# EasyEDA Pro project Usb_C_Hub-EasyEdaPro_Project.epro

# Schematic Schematic1_1
Board Name: Board1_1; Create Date: 2026-06-02; Page Name: P1; Project Name: Usb_Hub; Schematic Name: Schematic1_1; Update Date: 2026-06-02; Company: EasyEDA.com; Page Size: A4; Version: V1.0
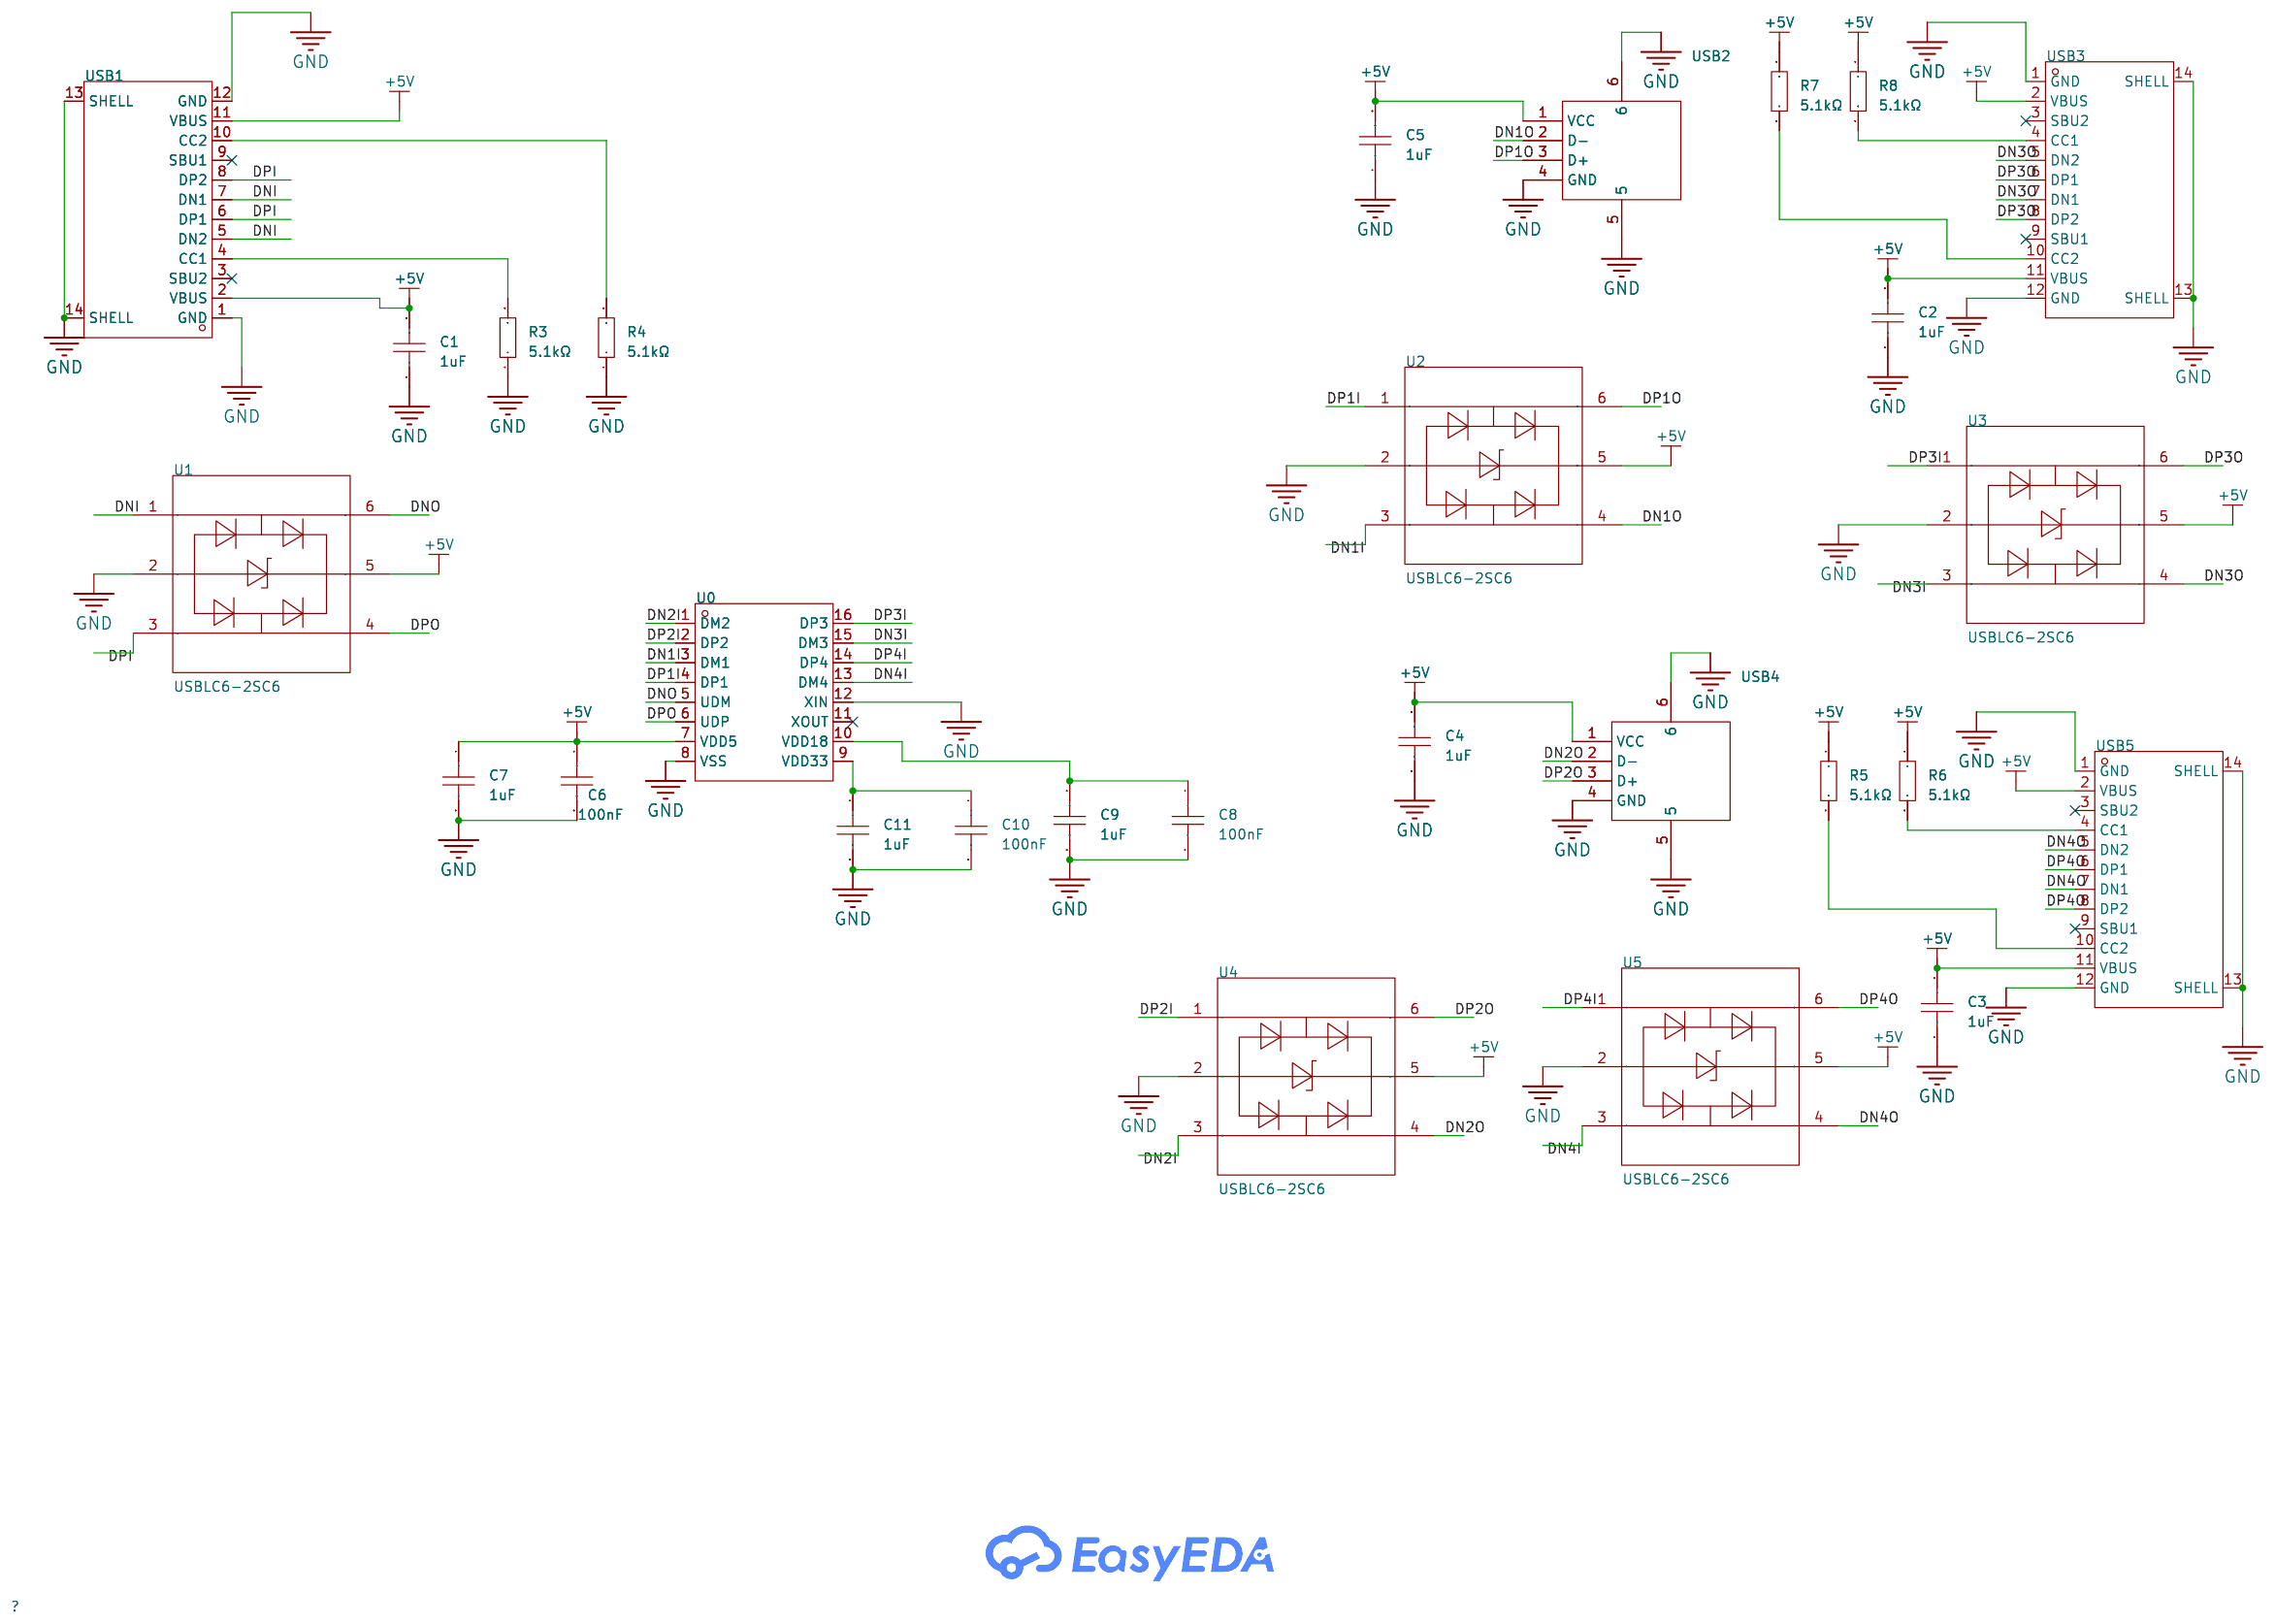
[diagram p0: schematic sheet]

## Parts
C1  1uF  [C0603]
C2  1uF  [C0603]
C3  1uF  [C0603]
C4  1uF  [C0603]
C5  1uF  [C0603]
C6  100nF  [C0603]
C7  1uF  [C0603]
C8  100nF  [C0603]
C9  1uF  [C0603]
C10  100nF  [C0603]
C11  1uF  [C0603]
R3  5.1kΩ  [R0603]
R4  5.1kΩ  [R0603]
R5  5.1kΩ  [R0603]
R6  5.1kΩ  [R0603]
R7  5.1kΩ  [R0603]
R8  5.1kΩ  [R0603]
U0  SL2.1s  [SSOP-16_L4.6-W2.6-P0.53-LS4.0-BL]
U1  USBLC6-2SC6  [SOT-23-6_L2.9-W1.6-P0.95-LS2.8-BR]
U2  USBLC6-2SC6  [SOT-23-6_L2.9-W1.6-P0.95-LS2.8-BR]
U3  USBLC6-2SC6  [SOT-23-6_L2.9-W1.6-P0.95-LS2.8-BR]
U4  USBLC6-2SC6  [SOT-23-6_L2.9-W1.6-P0.95-LS2.8-BR]
U5  USBLC6-2SC6  [SOT-23-6_L2.9-W1.6-P0.95-LS2.8-BR]
USB1  TYPE-C 16PIN 2MD(073)  [USB-C-SMD_TYPE-C-6PIN-2MD-073]
USB2  10.0 QHHTZB6.3  [USB-A-TH_10.0QHHTZB6.3]
USB3  TYPE-C 16PIN 2MD(073)  [USB-C-SMD_TYPE-C-6PIN-2MD-073]
USB4  10.0 QHHTZB6.3  [USB-A-TH_10.0QHHTZB6.3]
USB5  TYPE-C 16PIN 2MD(073)  [USB-C-SMD_TYPE-C-6PIN-2MD-073]

## Library data of the parts
C1-C5 C7 C9 C11 = CL10A105KB8NNNC: Capacitance:1uF Tolerance:±10% Tolerance:±10% Voltage Rating:50V Temperature Coefficient:X5R; LCSC Part Name: 1uF ±10% 50V; Supplier Part: C15849; Manufacturer: SAMSUNG(三星); Supplier Footprint: 0603; JLCPCB Part Class: Basic Part; Datasheet: https://item.szlcsc.com/datasheet/CL10A105KB8NNNC/16531.html; Supplier: LCSC; Tolerance: ±10%; Voltage Rating: 50V; Temperature Coefficient: X5R
C6 C8 C10 = CC0603KRX7R9BB104: Capacitance:100nF Tolerance:±10% Tolerance:±10% Voltage Rating:50V Temperature Coefficient:X7R; LCSC Part Name: 100nF ±10% 50V; Supplier Part: C14663; Manufacturer: YAGEO(国巨); Supplier Footprint: 0603; JLCPCB Part Class: Basic Part; Datasheet: https://item.szlcsc.com/datasheet/CC0603KRX7R9BB104/15331.html; Supplier: LCSC; Tolerance: ±10%; Voltage Rating: 50V; Temperature Coefficient: X7R
R3-R8 = 0603WAF5101T5E: Type:Thick Film Resistor Resistance:5.1kΩ Tolerance:±1% Tolerance:±1% Power(Watts):100mW Voltage-Supply(Max):75V Temperature Coefficient:±100ppm/℃ Temperature Coefficient:±100ppm/℃ Operating Temperature:-55℃~+155℃ Operating Temperature:-55℃~+155℃; LCSC Part Name: 5.1kΩ ±1% 100mW 厚膜电阻; Supplier Part: C23186; Manufacturer: UNI-ROYAL(厚声); Supplier Footprint: 0603; JLCPCB Part Class: Basic Part; Datasheet: https://item.szlcsc.com/datasheet/0603WAF5101T5E/23913.html; Supplier: LCSC; Type: Thick Film Resistor; Tolerance: ±1%; Power(Watts): 100mW; Voltage-Supply(Max): 75V; Temperature Coefficient: ±100ppm/℃; Operating Temperature: -55℃~+155℃
U0 = SL2.1s: type:Hub USB Protocol:USB 2.0 Voltage - Supply:4V~5.25V Voltage - Supply:4V~5.25V Operating Temperature:0℃~+70℃ Operating Temperature:0℃~+70℃ Current - Supply:120mA Quiescent Supply Current:2.5mA Number of Channels:4; LCSC Part Name: USB2.0 HUB控制器集成电路; Supplier Part: C2684433; Manufacturer: CoreChips(和芯润德); Supplier Footprint: SSOP-16; JLCPCB Part Class: Extended Part; Datasheet: https://item.szlcsc.com/datasheet/SL2.1s/2782346.html; Supplier: LCSC; type: Hub; USB Protocol: USB 2.0; Voltage - Supply: 4V~5.25V; Operating Temperature: 0℃~+70℃; Current - Supply: 120mA; Quiescent Supply Current: 2.5mA; Number of Channels: 4
U1-U5 = USBLC6-2SC6_C5261088: Polarity:Bidirectional Reverse Stand-Off Voltage (Vrwm):5V Clamping Voltage:14V Peak Pulse Current (Ipp):6A Voltage - Breakdown:6V Reverse Leakage Current (Ir):1uA Number of Channels:2 level of protection:IEC 61000-4-2 Type:ESD Junction Capacitance:0.5pF；; LCSC Part Name: 2路 双向ESD 5V截止 峰值脉冲电流：6A; Supplier Part: C5261088; Manufacturer: HXY MOSFET(华轩阳电子); Supplier Footprint: SOT-23-6L; JLCPCB Part Class: Extended Part; Datasheet: https://item.szlcsc.com/datasheet/USBLC6-2SC6/5983787.html; Supplier: LCSC; Polarity: Bidirectional; Reverse Stand-Off Voltage (Vrwm): 5V; Clamping Voltage: 14V; Peak Pulse Current (Ipp): 6A; Voltage - Breakdown: 6V; Reverse Leakage Current (Ir): 1uA; Number of Channels: 2; level of protection: IEC 61000-4-2; Type: ESD; Junction Capacitance: 0.5pF；0.8pF
USB1 USB3 USB5 = TYPE-C 16PIN 2MD(073): Connector Type:Type-C Protocol Standard:- Gender:Female Mounting Type:Surface Mount, Right Angle Number of Contacts:16P Number of Ports:1 Current Rating-Power:3A Voltage Rating:5V Connect-Disconnect Life:10,000 Cycles Supplementary Features:- Center Heigh; LCSC Part Name: Type-C 母 卧贴; Supplier Part: C2765186; Manufacturer: SHOU HAN(首韩); Supplier Footprint: SMD; JLCPCB Part Class: Extended Part; Datasheet: https://item.szlcsc.com/datasheet/TYPE-C%252016PIN%25202MD(073)/2901843.html; Supplier: LCSC; Connector Type: Type-C; Gender: Female; Mounting Type: Surface Mount, Right Angle; Number of Contacts: 16P; Number of Ports: 1; Current Rating-Power: 3A; Voltage Rating: 5V; Connect-Disconnect Life: 10,000 Cycles; Detection color: Black; Operating Temperature: -25℃~+85℃; Check: false
USB2 USB4 = 10.0 QHHTZB6.3: Connector Type:Type-A Protocol Standard:USB 2.0 Gender:Female Mounting Type:Surface Mount, Right Angle Number of Contacts:4P Number of Ports:1 Current Rating-Power:1.5A Voltage Rating:30V Connect-Disconnect Life:5,000 times Supplementary Features:- Center; LCSC Part Name: 壳长10.0mm; Supplier Part: C668591; Manufacturer: SHOU HAN(首韩); Supplier Footprint: SMD; JLCPCB Part Class: Extended Part; Datasheet: https://item.szlcsc.com/datasheet/10.0%2520QHHTZB6.3/698534.html; Supplier: LCSC; Connector Type: Type-A; Protocol Standard: USB 2.0; Gender: Female; Mounting Type: Surface Mount, Right Angle; Number of Contacts: 4P; Number of Ports: 1; Current Rating-Power: 1.5A; Voltage Rating: 30V; Connect-Disconnect Life: 5,000 times; Length: 10mm; Detection color: Black; Operating Temperature: -25℃~+85℃

## Nets
+5V: C1.2 C2.2 C3.2 C4.2 C5.2 C6.1 C7.1 R5.1 R6.1 R7.1 R8.1 U0.7(VDD5) U1.5 U2.5 U3.5 U4.5 U5.5 USB1.2(VBUS) USB1.11(VBUS) USB2.1(VCC) USB3.2(VBUS) USB3.11(VBUS) USB4.1(VCC) USB5.2(VBUS) USB5.11(VBUS)
GND: C1.1 C2.1 C3.1 C4.1 C5.1 C6.2 C7.2 C8.2 C9.2 C10.2 C11.2 R3.1 R4.1 U0.8(VSS) U0.12(XIN) U1.2 U2.2 U3.2 U4.2 U5.2 USB1.1(GND) USB1.12(GND) USB1.13(SHELL) USB1.14(SHELL) USB2.4(GND) USB2.5 USB2.6 USB3.1(GND) USB3.12(GND) USB3.13(SHELL) USB3.14(SHELL) USB4.4(GND) USB4.5 USB4.6 USB5.1(GND) USB5.12(GND) USB5.13(SHELL) USB5.14(SHELL)
DN1I: U0.3(DM1) U2.3
DN1O: U2.4 USB2.2(D-)
DN2I: U0.1(DM2) U4.3
DN2O: U4.4 USB4.2(D-)
DN3I: U0.15(DM3) U3.3
DN3O: U3.4 USB3.5(DN2) USB3.7(DN1)
DN4I: U0.13(DM4) U5.3
DN4O: U5.4 USB5.5(DN2) USB5.7(DN1)
DNI: U1.1 USB1.5(DN2) USB1.7(DN1)
DNO: U0.5(UDM) U1.6
DP1I: U0.4(DP1) U2.1
DP1O: U2.6 USB2.3(D+)
DP2I: U0.2(DP2) U4.1
DP2O: U4.6 USB4.3(D+)
DP3I: U0.16(DP3) U3.1
DP3O: U3.6 USB3.6(DP1) USB3.8(DP2)
DP4I: U0.14(DP4) U5.1
DP4O: U5.6 USB5.6(DP1) USB5.8(DP2)
DPI: U1.3 USB1.6(DP1) USB1.8(DP2)
DPO: U0.6(UDP) U1.4
$1N2151: R3.2 USB1.4(CC1)
$1N2154: R4.2 USB1.10(CC2)
$1N2984: R5.2 USB5.10(CC2)
$1N3131: R6.2 USB5.4(CC1)
$1N3260: R7.2 USB3.10(CC2)
$1N3267: R8.2 USB3.4(CC1)
$1N3816: C10.1 C11.1 U0.9(VDD33)
$1N3846: C8.1 C9.1 U0.10(VDD18)

Not connected (* = marked no-connect by the designer): U0 11(XOUT)*; USB1 3(SBU2)* 9(SBU1)*; USB3 3(SBU2)* 9(SBU1)*; USB5 3(SBU2)* 9(SBU1)*

# Board PCB1_1
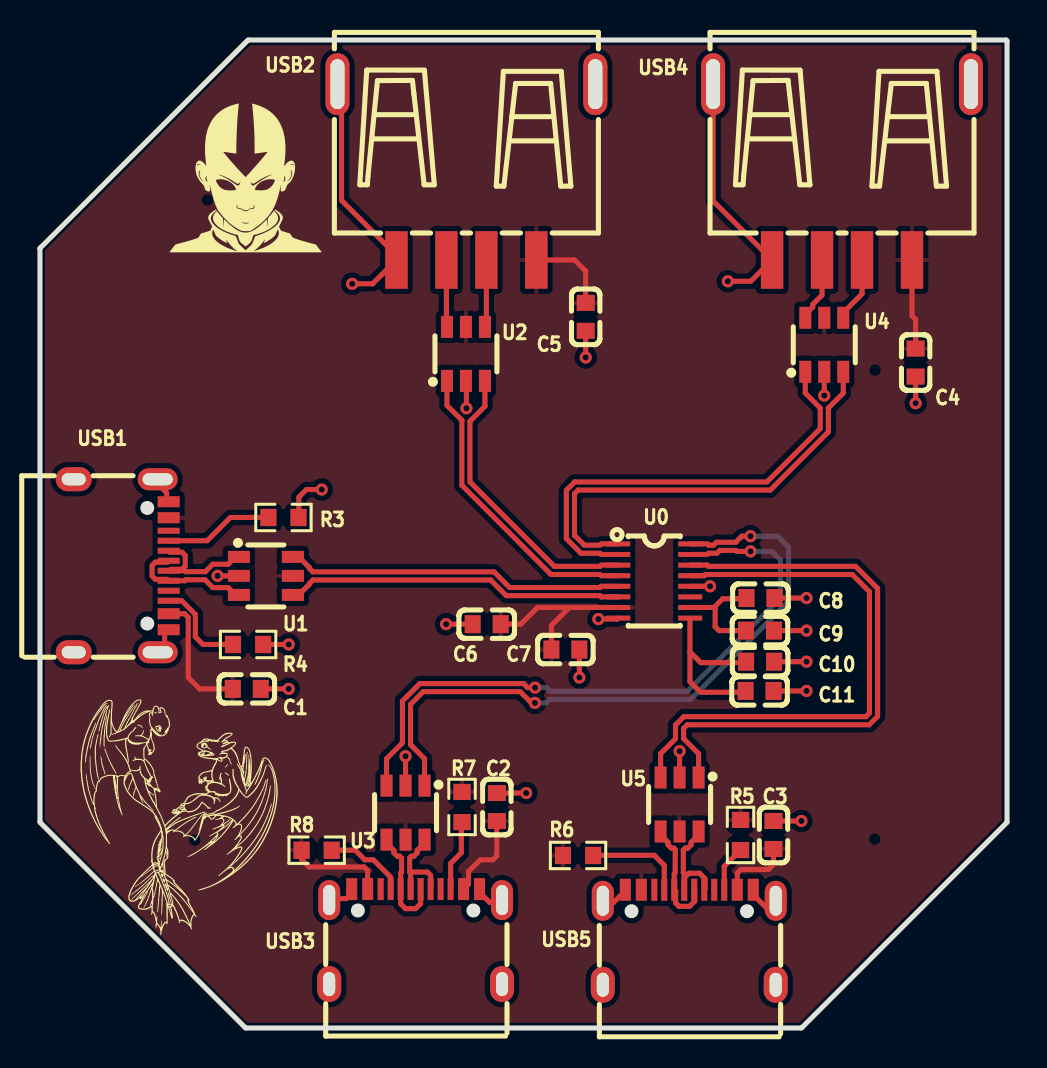
[diagram p1: board, top side]
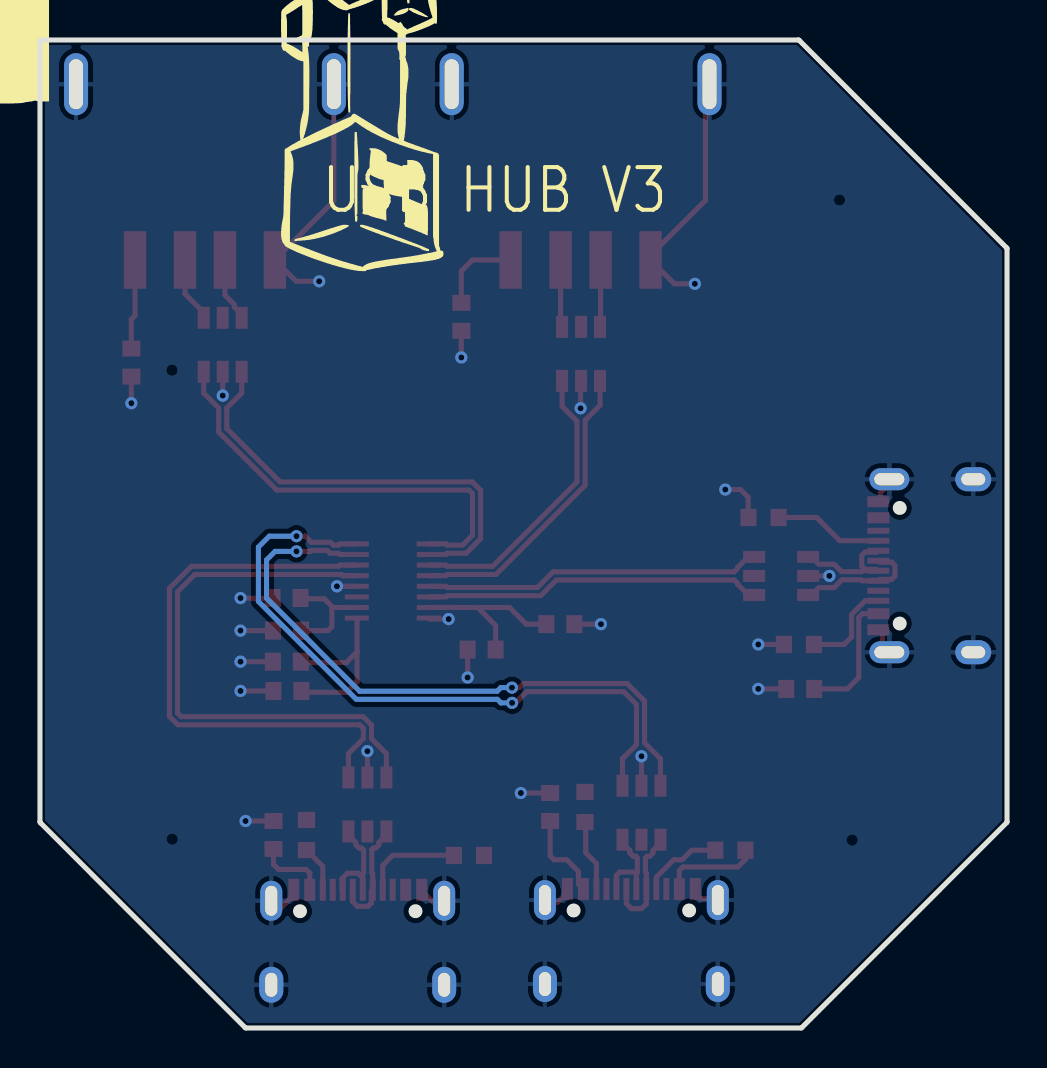
[diagram p2: board, bottom side, seen from below]

Outline 48.39 x 49.4 mm; copper layers: Top Layer, Bottom Layer. Coordinates in mm from the lower left corner of the outline.
Outline path: 0,38.97 0,10.31 arc(0,10.29) 0.02,10.27 10.27,0.01 arc(10.29,0) 10.31,0 38.08,0 arc(38.1,0) 38.11,0.01 48.37,10.27 arc(48.38,10.29) 48.39,10.31 48.39,49.35 arc(48.37,49.39) 48.34,49.4 10.44,49.4 arc(10.42,49.4) 10.4,49.39 0.02,39 arc(0,38.99) 0,38.97
Stack: Top Layer 0.035mm / Dielectric1 1.51mm FR4 er 4.5 / Bottom Layer 0.035mm

## Design rules (mm)
net DNO: DP2
net DPO: DP2
net DN2I: DP11
net DP2I: DP11
net DN4O: DP6
net DP4O: DP6
net DN3O: DP3
net DP3O: DP3
net DP1O: DP8
net DN1O: DP8
net DP2O: DP10
net DN2O: DP10
net DN1I: DP9
net DP1I: DP9
net DN3I: DP5
net DP3I: DP5
net DN4I: DP7
net DP4I: DP7
net DPI: DP1
net DNI: DP1
template: Custom Config
spacing copperThickness1oz (default): track to track 0.102, other pairs 0.152 to 0.3
spacing copperThickness2oz: track to track 0.203, other pairs 0.152 to 0.3
track width copperThickness1oz (default): min 0.127, default 0.254, max 2.54
track width copperThickness2oz: min 0.203, default 0.254, max 2.54
differential pair differentialPair (default): width min 0.127, default 0.254, max 2.54; gap min 0.152, default 0.152
via viaSize (default): diameter min 0.5, default 0.61, max 10; hole min 0.3, default 0.305, max 6.3

## Placement (name value [footprint] x y rotation side)
C1  1uF  [C0603]  10.35 16.96 180 top
C2  1uF  [C0603]  22.86 11.05 270 top
C3  1uF  [C0603]  36.7 9.65 270 top
C4  1uF  [C0603]  43.82 33.27 90 top
C5  1uF  [C0603]  27.3 35.56 90 top
C6  100nF  [C0603]  22.35 20.19 180 top
C7  1uF  [C0603]  26.29 18.92 0 top
C8  100nF  [C0603]  36.05 21.5 0 top
C9  1uF  [C0603]  36.03 19.87 0 top
C10  100nF  [C0603]  36.03 18.32 0 top
C11  1uF  [C0603]  36.01 16.85 0 top
R3  5.1kΩ  [R0603]  12.18 25.53 180 top
R4  5.1kΩ  [R0603]  10.41 19.18 180 top
R5  5.1kΩ  [R0603]  35.05 9.65 270 top
R6  5.1kΩ  [R0603]  26.92 8.63 0 top
R7  5.1kΩ  [R0603]  21.12 11.05 270 top
R8  5.1kΩ  [R0603]  13.84 8.89 0 top
U0  SL2.1s  [SSOP-16_L4.6-W2.6-P0.53-LS4.0-BL]  30.73 22.35 270 top
U1  USBLC6-2SC6  [SOT-23-6_L2.9-W1.6-P0.95-LS2.8-BR]  11.3 22.61 180 top
U2  USBLC6-2SC6  [SOT-23-6_L2.9-W1.6-P0.95-LS2.8-BR]  21.31 33.71 270 top
U3  USBLC6-2SC6  [SOT-23-6_L2.9-W1.6-P0.95-LS2.8-BR]  18.29 10.77 90 top
U4  USBLC6-2SC6  [SOT-23-6_L2.9-W1.6-P0.95-LS2.8-BR]  39.24 34.16 270 top
U5  USBLC6-2SC6  [SOT-23-6_L2.9-W1.6-P0.95-LS2.8-BR]  32 11.18 90 top
USB1  TYPE-C 16PIN 2MD(073)  [USB-C-SMD_TYPE-C-6PIN-2MD-073]  4.06 23.11 270 top
USB2  10.0 QHHTZB6.3  [USB-A-TH_10.0QHHTZB6.3]  21.34 42.8 180 top
USB3  TYPE-C 16PIN 2MD(073)  [USB-C-SMD_TYPE-C-6PIN-2MD-073]  18.8 4.57 0 top
USB4  10.0 QHHTZB6.3  [USB-A-TH_10.0QHHTZB6.3]  40.13 42.8 180 top
USB5  TYPE-C 16PIN 2MD(073)  [USB-C-SMD_TYPE-C-6PIN-2MD-073]  32.49 4.54 0 top

## Footprints (pads in the part's own frame, mm; a bottom-side part is the same pattern mirrored in y, then rotated)
C0603
  rect 0.8x0.9 smd: 1(-0.7,0) 2(0.7,0)
R0603
  rect 0.806x0.864 smd: 1(-0.753,0) 2(0.753,0)
SOT-23-6_L2.9-W1.6-P0.95-LS2.8-BR
  rect 1.1x0.6 smd: 1(1.35,-0.95) 2(1.35,0) 3(1.35,0.95) 4(-1.35,0.95) 5(-1.35,0) 6(-1.35,-0.95)
SSOP-16_L4.6-W2.6-P0.53-LS4.0-BL
  rect 0.25x1.2 smd: 1(-1.855,-1.8) 2(-1.325,-1.8) 3(-0.795,-1.8) 4(-0.265,-1.8) 5(0.265,-1.8) 6(0.795,-1.8) 7(1.325,-1.8) 8(1.855,-1.8) 9(1.855,1.8) 10(1.325,1.8) 11(0.795,1.8) 12(0.265,1.8) 13(-0.265,1.8) 14(-0.795,1.8) 15(-1.325,1.8) 16(-1.855,1.8)
USB-A-TH_10.0QHHTZB6.3
  rect 1.12x2.88 smd: 1(-3.5,4.395) 2(-1,4.395) 3(1,4.395) 4(3.5,4.395)
  oval 1.2x3.1 hole 0.7x2.5: 5(-6.45,-4.395) 6(6.45,-4.395)
USB-C-SMD_TYPE-C-6PIN-2MD-073
  rect 0.55x1.1 smd: 1(-3.2,2.375) 2(-2.4,2.375) 11(2.4,2.375) 12(3.2,2.375)
  rect 0.3x1.1 smd: 3(-1.75,2.375) 4(-1.25,2.375) 5(-0.75,2.375) 6(-0.25,2.375) 7(0.25,2.375) 8(0.75,2.375) 9(1.25,2.375) 10(1.75,2.375)
  oval 1.1x2 hole 0.6x1.5: 13(-4.325,1.825) 14(4.325,1.825)
  oval 1.2x1.8 hole 0.6x1.2: 13(-4.325,-2.375) 14(4.325,-2.375)

## Nets
As in the schematic.

Pads without a net: U0 11; USB1 3 9; USB3 3 9; USB5 3 9

## Via types
v1: diameter 0.61, hole 0.305, Top Layer to Bottom Layer, 26 vias

## Routing (per net, layer and track width the routed paths; a pad name or vN(x,y) marks a point on that pad's centre or on a via; arc(x,y) is an arc through that point)
+5V: length 37
  Top Layer w0.254: R8.1 13.09,8.43 13.46,8.05 16.22,8.05 16.4,7.87 USB3.2 ; C4.2 43.82,35.43 43.63,35.62 USB4.1 ; 26.49,21.03 25.59,20.13 C7.1 ; 26.49,21.03 24.89,21.03 24.06,20.19 C6.1 ; 26.49,21.03 27.69,21.03 27.7,21.03 28.18,21.03 28.19,21.03 28.93,21.03 ; C1.2 7.99,16.96 7.42,17.53 7.42,20.53 7.24,20.71 USB1.11 ; C5.2 27.3,37.85 26.75,38.4 USB2.1 ; C2.2 22.86,8.61 22.66,8.41 22.03,8.41 21.44,7.82 21.44,7.19 USB3.11 ; USB5.11 34.89,7.75 35.07,7.93 36.45,7.93 36.7,8.18 C3.2
GND: length 60.5
  Top Layer w0.254: U2.2 21.34,32.34 v1(21.34,30.99) ; C5.1 v1(27.3,33.53) ; C1.1 v1(12.45,16.96) ; 17.73,38.74 15.09,41.38 15.09,46.96 ; v1(15.62,37.21) 16.64,37.21 USB2.4 ; C4.1 v1(43.82,31.24) ; U5.2 v1(32,13.84) ; C9.2 v1(38.35,19.87) ; 36.75,21.5 v1(38.35,21.5) ; 28.93,20.5 28.88,20.45 v1(27.94,20.45) ; 6.24,19.72 6.24,19.11 5.9,18.77 ; 36.63,6.03 36.32,6.03 35.66,6.69 ; C3.1 v1(38.1,10.35) ; U1.2 v1(8.89,22.61) ; U0.12 v1(33.53,22.09) ; R4.1 v1(12.45,19.18) ; 6.34,26.23 6.34,26.76 5.76,27.33 ; 29.28,6.86 28.7,6.28 28.29,6.28 ; C7.2 v1(26.99,17.53) ; 15.69,6.82 15.33,6.47 14.44,6.47 ; C10.2 v1(38.35,18.32) ; 21.65,20.19 v1(20.32,20.19) ; 21.88,6.9 22.5,6.28 22.98,6.28 ; U4.2 v1(39.24,31.62) ; v1(34.42,37.34) 35.57,37.34 USB4.4 33.68,41.35 USB4.6 ; C11.2 v1(38.35,16.85) ; v1(14.1,26.92) 13.33,26.92 12.95,26.54 12.95,25.54 R3.1 ; U3.2 v1(18.29,13.59) ; C2.1 v1(24.33,11.75)
DN1I: length 14.6
  Top Layer w0.254: 28.93,23.15 28.08,23.15 28.02,23.08 25.74,23.08 21.52,27.3 21.52,30.34 22.26,31.09 U2.3
DN1O: length 3.4
  Top Layer w0.254: U2.4 22.34,35.13 USB2.2
DN2I: length 21.8
  Top Layer w0.254: U4.3 40.19,31.75 39.45,31 39.45,29.8 36.54,26.9 26.92,26.9 26.74,26.72 26.74,24.64 27.24,24.14 28.02,24.14 28.08,24.21 28.93,24.21
DN2O: length 3.3
  Top Layer w0.254: U4.4 40.33,35.66 40.33,35.91 41.13,36.71 USB4.2
DN3I: length 32.6
  Top Layer w0.254: v1(35.55,23.83) 34.87,23.83 34.82,23.88 34.02,23.88 33.87,23.74 33.45,23.74 33.39,23.68 U0.15 ; U3.3 17.34,13.46 18.14,14.26 18.14,16.35 19.01,17.22 24.2,17.22 24.4,17.02 v1(24.77,17.02)
  Bottom Layer w0.254: v1(35.55,23.83) 36.62,23.83 37.05,23.4 37.05,21.5 32.4,16.84 25.51,16.84 25.33,17.02 v1(24.77,17.02)
DN3O: length 5.5
  Top Layer w0.254: U3.4 17.34,9.25 17.71,8.88 17.71,8.75 17.88,8.59 18,8.59 18.09,8.5 18.09,7.8 18.05,7.75 USB3.5 18.05,6.21 18.29,5.97 18.8,5.97 19.05,6.22 USB3.7
DN4I: length 28.3
  Top Layer w0.254: U0.13 33.23,22.62 33.29,22.67 33.44,22.67 33.45,22.68 40.64,22.68 41.5,21.81 41.5,15.75 41.32,15.57 32.22,15.57 31.8,15.15 31.8,14.46 31.05,13.72 U5.3
DN4O: length 5.7
  Top Layer w0.254: USB5.7 32.76,6.89 32.76,6.34 32.5,6.08 31.97,6.08 31.81,6.25 31.81,6.84 USB5.5 31.74,7.71 31.78,7.76 31.78,8.93 31.71,9 31.59,9 31.42,9.16 31.42,9.29 31.05,9.66 U5.4
DNI: length 6.2
  Top Layer w0.254: USB1.5 6.51,23.79 7.1,23.79 7.27,23.63 7.27,23.1 7.1,22.93 6.58,22.93 6.54,22.89 6.46,22.89 USB1.7 7.24,22.86 7.29,22.82 8.28,22.82 8.65,23.19 9.42,23.19 9.78,23.56 9.95,23.56
DNO: length 17
  Top Layer w0.254: 28.93,22.09 28.08,22.09 28.02,22.02 23.5,22.02 22.72,22.81 13.65,22.81 13.48,22.98 13.48,23.02 12.95,23.56 12.65,23.56
DP1I: length 15.2
  Top Layer w0.254: U2.1 20.36,31.13 21.11,30.39 21.11,27.14 25.57,22.68 28.02,22.68 28.08,22.62 28.93,22.62
DP1O: length 3.4
  Top Layer w0.254: U2.6 20.34,35.09 USB2.3
DP2I: length 22.5
  Top Layer w0.254: U4.1 38.29,31.75 39.04,31 39.04,29.97 36.37,27.3 26.76,27.3 26.34,26.89 26.34,24.47 27.07,23.74 28.02,23.74 28.08,23.68 28.93,23.68
DP2O: length 3.2
  Top Layer w0.254: USB4.3 39.13,36.65 38.66,36.18 38.66,36.05 38.29,35.68 U4.6
DP3I: length 33.9
  Top Layer w0.254: v1(24.77,16.26) 24.59,16.26 24.03,16.82 19.18,16.82 18.54,16.18 18.54,14.16 19.24,13.46 U3.1 ; U0.16 33.39,24.21 33.45,24.14 33.7,24.14 33.85,24.29 34.82,24.29 35.12,24.59 v1(35.55,24.59)
  Bottom Layer w0.254: v1(35.55,24.59) 36.91,24.59 37.46,24.04 37.46,21.33 32.56,16.44 25.5,16.44 25.32,16.26 v1(24.77,16.26)
DP3O: length 4.7
  Top Layer w0.254: 18.5,7.8 18.55,7.75 USB3.6 ; 18.5,7.8 19.38,7.8 19.55,7.63 USB3.8 ; 18.5,7.8 18.5,8.51 18.58,8.59 18.71,8.59 18.87,8.75 18.87,8.88 19.24,9.25 U3.6
DP4I: length 29
  Top Layer w0.254: U5.1 32.95,13.72 32.21,14.47 32.21,14.98 32.39,15.16 41.49,15.16 41.91,15.58 41.91,21.98 40.81,23.08 33.45,23.08 33.39,23.15 U0.14
DP4O: length 5.1
  Top Layer w0.254: U5.6 32.95,9.66 32.58,9.29 32.58,9.16 32.42,9 32.29,9 32.19,8.89 32.19,7.76 32.24,7.71 32.24,7.51 ; USB5.8 33.27,6.95 33.27,7.47 33,7.74 32.47,7.74 32.24,7.51 ; 32.24,7.51 USB5.6
DPI: length 6.2
  Top Layer w0.254: USB1.6 6.37,23.29 5.77,23.29 5.61,23.13 5.61,22.6 5.77,22.43 6.37,22.43 USB1.8 7.24,22.36 7.29,22.41 8.26,22.41 8.65,22.02 9.42,22.02 9.78,21.66 U1.3
DPO: length 17
  Top Layer w0.254: 28.93,21.56 28.08,21.56 28.02,21.62 23.33,21.62 22.55,22.4 13.65,22.4 13.48,22.23 13.48,22.19 12.95,21.66 U1.4
$1N2151: length 5.5
  Top Layer w0.254: R3.2 9.53,25.53 8.36,24.36 USB1.4
$1N2154: length 4.8
  Top Layer w0.254: R4.2 8.16,19.18 7.77,19.56 7.77,20.68 7.09,21.36 USB1.10
$1N2984: length 2.3
  Top Layer w0.254: USB5.10 34.24,8.08 R5.2
$1N3131: length 5
  Top Layer w0.254: USB5.4 31.24,8.13 30.73,8.64 27.68,8.64 R6.2
$1N3260: length 3.6
  Top Layer w0.254: R7.2 21.08,10.26 21.08,8.76 20.55,8.23 USB3.10
$1N3267: length 4.1
  Top Layer w0.254: USB3.4 17.55,7.54 16.68,8.41 16.26,8.41 15.78,8.89 R8.2
$1N3816: length 9.2
  Top Layer w0.254: 32.52,18.81 32.52,17.32 33.05,16.79 35.24,16.79 C11.1 ; 32.52,18.81 32.52,20.43 32.55,20.46 ; 32.52,18.81 33.06,18.27 35.29,18.27 C10.1
$1N3846: length 5.6
  Top Layer w0.254: C9.1 33.98,19.87 33.78,20.07 33.78,20.97 33.73,21.03 ; 33.73,21.03 34.16,21.46 35.31,21.46 35.35,21.5 ; 33.73,21.03 U0.10

## Copper pours and planes (outline as drawn; the poured copper is in the pictures)
+5V on Top Layer: -4.83,51.82 55.88,51.82 55.88,-2.41 -4.83,-2.41
GND on Bottom Layer: -4.58,50.65 52.79,50.65 52.79,-2.18 -4.58,-2.18
GND on Bottom Layer: -9.27,54.39 59.78,54.39 59.78,-10.99 -9.27,-10.99

## Text on the board
Bottom Silkscreen Layer: USB HUB V3
